# Altium schematic sheet Single_Channel_fNIRS.SchDoc
size A; SheetNumber: 1; SheetTotal: 1
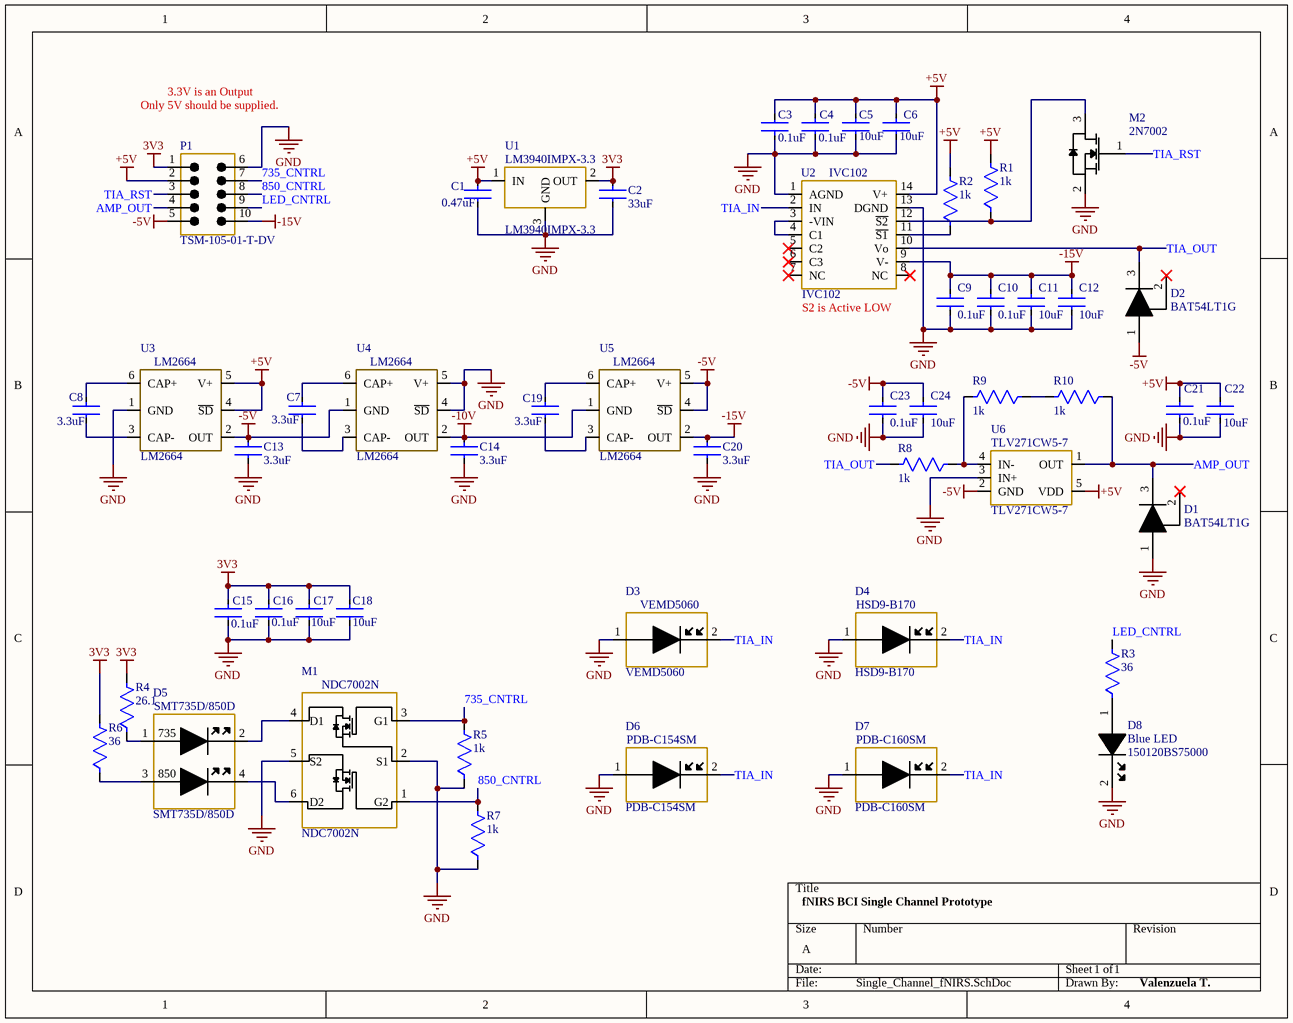
[diagram p0: Single_Channel_fNIRS.SchDoc]

## Parts
C1  0.47uF  [CAPC3216X180N]
C2  33uF  [CAPC3216X180N]
C3  0.1uF  [CAPC3216X180N]
C4  0.1uF  [CAPC3216X180N]
C5  10uF  [CAPC3216X180N]
C6  10uF  [CAPC3216X180N]
C7  3.3uF  [CAPC1210(3225)190_M]
C8  3.3uF  [CAPC1210(3225)190_M]
C9  0.1uF  [CAPC3216X180N]
C10  0.1uF  [CAPC3216X180N]
C11  10uF  [CAPC3216X180N]
C12  10uF  [CAPC3216X180N]
C13  3.3uF  [CAPC1210(3225)190_M]
C14  3.3uF  [CAPC1210(3225)190_M]
C15  0.1uF  [CAPC3216X180N]
C16  0.1uF  [CAPC3216X180N]
C17  10uF  [CAPC3216X180N]
C18  10uF  [CAPC3216X180N]
C19  3.3uF  [CAPC1210(3225)190_M]
C20  3.3uF  [CAPC1210(3225)190_M]
C21  0.1uF  [CAPC3216X180N]
C22  10uF  [CAPC3216X180N]
C23  0.1uF  [CAPC3216X180N]
C24  10uF  [CAPC3216X180N]
D1  BAT54LT1G  [BAT54LT1]
D2  BAT54LT1G  [BAT54LT1]
D3  VEMD5060  [VEMD5060]
D4  HSD9-B170  [HSD9-B170]
D5  SMT735D/850D  [SMT735D_850D]
D6  PDB-C154SM  [PDB-C154SM]
D7  PDB-C160SM  [DS-PDB-C160SM]
D8  Blue LED  [150120BS75000]
M1  NDC7002N  [FAIR-MA06A_V]
M2  2N7002  [STM-SOT-23-3_V]
P1  TSM-105-01-T-DV  [SAMTEC_TSM-105-01-T-DV-TR]
R1  1k  [R1206]
R2  1k  [R1206]
R3  36  [R1206]
R4  26.1  [R1206]
R5  1k  [R1206]
R6  36  [R1206]
R7  1k  [R1206]
R8  1k  [R1206]
R9  1k  [R1206]
R10  1k  [R1206]
U1  LM3940IMPX-3.3  [LM3940]
U2  IVC102  [D0014A_M]
U3  LM2664  [LM2664]
U4  LM2664  [LM2664]
U5  LM2664  [LM2664]
U6  TLV271CW5-7  [SOT95P285X145-5N]

## Nets
3V3: C2.1 C15.1 C16.1 C17.1 C18.1 P1.1 R4.2 R6.2 U1.2(OUT)
+5V: C1.1 C3.2 C4.1 C5.1 C6.1 C21.1 C22.1 P1.2 R1.2 R2.2 U1.1(IN) U2.14(V+) U3.4(~{SD}) U3.5(V+) U6.5(VDD)
-5V: C13.1 C23.1 C24.1 D2.1(A) P1.5 U3.2(OUT) U4.1(GND) U5.4(~{SD}) U5.5(V+) U6.2(GND)
-10V: C14.1 U4.2(OUT) U5.1(GND)
-15V: C9.1 C10.1 C11.1 C12.1 C20.1 P1.10 U2.9(V-) U5.2(OUT)
GND: C1.2 C2.2 C3.1 C4.2 C5.2 C6.2 C9.2 C10.2 C11.2 C12.2 C13.2 C14.2 C15.2 C16.2 C17.2 C18.2 C20.2 C21.2 C22.2 C23.2 C24.2 D1.1(A) D3.1 D4.1 D6.1 D7.1 D8.2 M1.2(S1) M1.5(S2) M2.2(S) P1.6 R5.1 R7.1 U1.3(GND) U2.1(AGND) U2.13(DGND) U3.1(GND) U4.4(~{SD}) U4.5(V+) U6.3(IN+)
735_CNTRL: M1.3(G1) P1.7 R5.2
850_CNTRL: M1.1(G2) P1.8 R7.2
AMP_OUT: D1.3(K) P1.4 R10.1 U6.1(OUT)
LED_CNTRL: P1.9 R3.2
TIA_IN: D3.2 D4.2 D6.2 D7.2 U2.2(IN)
TIA_OUT: D2.3(K) R8.2 U2.10(Vo)
TIA_RST: M2.1(G) P1.3
NetC7_1: C7.1 U4.6(CAP+)
NetC7_2: C7.2 U4.3(CAP-)
NetC8_1: C8.1 U3.6(CAP+)
NetC8_2: C8.2 U3.3(CAP-)
NetC19_1: C19.1 U5.6(CAP+)
NetC19_2: C19.2 U5.3(CAP-)
NetD5_1: D5.1 R4.1
NetD5_2: D5.2 M1.4(D1)
NetD5_3: D5.3 R6.1
NetD5_4: D5.4 M1.6(D2)
NetD8_1: D8.1 R3.1
NetM2_3: M2.3(D) R1.1 U2.12(~{S2})
NetR2_1: R2.1 U2.11(~{S1})
NetR8_1: R8.1 R9.2 U6.4(IN-)
NetR9_1: R9.1 R10.2
NetU2_3: U2.3(-VIN) U2.4(C1)

Not connected (* = marked no-connect by the designer): D1 2(NC)*; D2 2(NC)*; U2 5(C2)* 6(C3)* 7(NC)* 8(NC)*

## Notes on the sheet
- 3.3V is an Output
- Only 5V should be supplied.
- (near U2) S2 is Active LOW
- fNIRS BCI Single Channel Prototype
- 1
- Valenzuela T.
- (in symbol SMT735D/850D) 735; 850

## Library data of the parts
C1 = C3216X7R2A474K160AA: 1206
C2 = C3216X5R1E336M160AC: 1206
C3 C4 C9 C10 C15 C16 C21 C23 = C1206C104K5RAC7210: 1206; Manufacturer: KEMET; Tolerance: 0.1; Material: Ceramic; Voltage Rating: 50 V; Temperature Characteristic: X7R; Automotive Grade: Grade 0; Capacitance: 0.10 μF; Value: 0.10 μF; Temperature Coefficient: 15%; Device Class L3: Ceramic Capacitors; ComponentLink2URL: https://content.kemet.com/datasheets/KEM_C1007_X8R_ULTRA_150C_SMD.pdf; Temperature Range Low: -55°C; RoHS: TRUE; Temperature Range High: +150°C; Automotive: Yes; Height: 0.88mm; Manufacturer Part Number: C1206C104K5RAC7210; Temperature: -55°C to +150°C; Octopart: https://octopart.com/c1206c104k5rac7210-kemet-3919856; Package: C1206C-EB; Mouser Description: Multilayer Ceramic Capacitors MLCC - SMD/SMT 50volts 0.1uF X7R 10%; Ipc Land Pattern Name: CAPC320160X78; Device Class L2: Capacitors; Category: Cap; Lead Free: Yes; ComponentLink2Description: Datasheet; Digikey Description: CAP CER 0.1UF 50V X7R 1206; Device Class L1: Passive Components
C5 C6 C11 C12 C17 C18 C22 C24 = CL31B106KOHNNWE: 1206
C7 C8 C13 C14 C19 C20 = C1210C335K5RAC7800: 1210
D1 D2 = BAT54L: Schottky Barrier Diode, 3-Pin SOT-23, Pb-Free, Tape and Reel; Manufacturer: On Semiconductor; IFSM Max (A): 0.6; Configuration: Single; trr Max (ns): 5; PackageVersion: Rev. AP, 11/2009; ComponentLink3Description: Package Specification; RoHS: TRUE; ComponentLink3URL: http://www.onsemi.cn/pub_link/Collateral/318-08.PDF; PackageDescription: 3-Pin Small Outline Transistor, Body 2.92 x 1.3 mm, Pitch 0.95 mm; DatasheetVersion: Rev. 12; ComponentLink1Description: Manufacturer URL; PartNumber: BAT54LT1G; ComponentLink2Description: Datasheet; Mounting Technology: Surface Mount; PackageReference: SOT-23-3-318-08; ComponentLink2URL: http://www.onsemi.cn/pub_link/Collateral/BAT54LT1-D.PDF; ComponentLink1URL: http://www.onsemi.com/; Packing: Tape and Reel
D8 = 150120BS75000: Single Color LED, Blue, Water Clear, 2mm; Manufacturer: Wurth Electronics; Shape: Rectangular; Forward Current-Max: 30mA; Luminous Intensity-Nom: 145mcd; Number of Functions: 1; Viewing Angle: 140°; Overall Height: 0.68mm; Supplier 1: Newark; Manufacturer Part Number: 150120BS75000; RoHS: Yes; Category: LEDs; Stock 1: 1765; Pricing 1: 1=0.262, 10=0.257, 25=0.25, 50=0.242, 100=0.212, 500=0.194 (USD); Mount: Surface Mount; Number of Pins: 2; Color: Blue; Min Operating Temperature: -40°C; Max Operating Temperature: 85°C; Lens Style: WATER CLEAR; Optoelectronic Device Type: SINGLE COLOR LED; Packaging: Tape and Reel; Size: 2mm; Terminal Pitch: 3mm; Reach SVHC Compliant: Yes; RoHS Compliant: Yes; ComponentLink1URL: https://datasheet.ciiva.com:443/pdfs/VipMasterIC/IC/MIDC/MIDC-S-A0007455946/MIDC-S-A0007455946-1.pdf?src-supplier=IHS+Markit; ComponentLink1Description: https://datasheet.ciiva.com:443/pdfs/VipMasterIC/IC/MIDC/MIDC-S-A0007455946/MIDC-S-A0007455946-1.pdf?src-supplier=IHS+Markit; ComponentLink2URL: https://datasheet.ciiva.com/22656/150120bs75000-22656976.pdf?src-supplier=Element14; ComponentLink2Description: https://datasheet.ciiva.com/22656/150120bs75000-22656976.pdf?src-supplier=Element14; ComponentLink3URL: https://datasheet.ciiva.com/29279/759440-da-01-en-chipled-1206-w-kl-blau-150120bs75000-29279045.pdf?src-supplier=Conrad; ComponentLink3Description: https://datasheet.ciiva.com/29279/759440-da-01-en-chipled-1206-w-kl-blau-150120bs75000-29279045.pdf?src-supplier=Conrad; ComponentLink4URL: https://datasheet.ciiva.com/29561/150120bs75000-29561882.pdf?src-supplier=Digikey; ComponentLink4Description: https://datasheet.ciiva.com/29561/150120bs75000-29561882.pdf?src-supplier=Digikey; Supplier Part Number 1: 150120BS75000
M2 = 2N7002-TP: N-channel 60 V, 1.8 Ohm, 0.35 A STripFET(TM) II Power MOSFET, SOT23; Manufacturer: STMicroelectronics; PartNumber: 2N7002; ComponentLink2Description: Datasheet; ComponentLink2URL: http://www.st.com/st-web-ui/static/active/en/resource/technical/document/datasheet/CD00005134.pdf; ComponentLink1Description: Manufacturer URL; ComponentLink1URL: http://www.st.com/; DatasheetVersion: Rev. 9, 11/2008; PackageReference: SOT-23; Mounting Technology: Surface Mount; PackageDescription: 3-Pin SOT23, 3.016 x 2.8 mm Body, 0.95 mm Pitch
P1 = TSM-105-01-T-DV: 0.025" SQ Post Header, Surface Mount, Vertical, -55 to 105 degC, 2.54 mm Pitch, 10-Pin, Male, RoHS; Manufacturer: Samtec; Pitch: 2.54 mm; ComponentLink3Description: Package Specification; ComponentLink2URL: http://www.samtec.com/documents/webfiles/pdf/TSM.PDF; DatasheetVersion: F-214; Temperature Range: -55 to 105 degC; PackageReference: TSM-105-01-X-DV; PartNumber: TSM-105-01-T-DV; ComponentLink2Description: Datasheet; PackageVersion: DJ, 4/1991; ComponentLink3URL: http://www.samtec.com/documents/webfiles/cpdf/TSM-1XX-XX-XXX-XX-X-XXX-X-MKT.pdf; ComponentLink1URL: http://www.samtec.com; Orientation: Vertical; ComponentLink1Description: Manufacturer URL; RoHS: True; PackageDescription: Double Row Gullwing ASM; Mounting Technology: Surface Mount
R1 R2 R5 R7-R10 = RT1206BRD071KL: 1206 1kOhm
R3 R6 = RT1206BRD0736RL: 1206 36 Ohm; Manufacturer: Yageo; Tolerance: 0.1%; Additional Feature: HIGH PRECISION; Rated Power Dissipation (P): 250mW; Rated Temperature: 70°C; Resistance: 36R; Temperature Coefficient: 25ppm/°C; Working Voltage: 200V; Package Height: 0.55mm; Package Length: 3.1mm; Package Width: 1.6mm; Supplier 1: Digikey; Manufacturer Part Number: RT1206BRD0736RL; RoHS: Yes; Category: Chip SMD Resistors; Stock 1: 9860; Pricing 1: 1=0.33, 10=0.241, 50=0.1868, 100=0.166, 500=0.1245, 1000=0.10938 (USD); Mount: Surface Mount; Number of Pins: 2; Size Code: 1206; Min Operating Temperature: -55°C; Max Operating Temperature: 155°C; Resistor Type: FIXED RESISTOR; Construction: Chip; Package Style: SMTMeter; Packaging: Tape and Reel; Technology: THIN FILM; Termination: Wraparound; Reach SVHC Compliant: Yes; RoHS Compliant: Yes; ComponentLink1URL: https://datasheet.ciiva.com:443/pdfs/VipMasterIC/IC/YAGO/YAGO-S-A0008510989/YAGO-S-A0008510989-1.pdf?src-supplier=IHS+Markit; ComponentLink1Description: https://datasheet.ciiva.com:443/pdfs/VipMasterIC/IC/YAGO/YAGO-S-A0008510989/YAGO-S-A0008510989-1.pdf?src-supplier=IHS+Markit; ComponentLink2URL: https://datasheet.ciiva.com/2587/pyu-rt-1-to-0-05-rohs-l-5-2587658.pdf?src-supplier=Digikey; ComponentLink2Description: https://datasheet.ciiva.com/2587/pyu-rt-1-to-0-05-rohs-l-5-2587658.pdf?src-supplier=Digikey; ComponentLink3URL: https://datasheet.ciiva.com/12811/pyu-rt-1-to-0-05-rohs-l-4-12811975.pdf?src-supplier=Mouser; ComponentLink3Description: https://datasheet.ciiva.com/12811/pyu-rt-1-to-0-05-rohs-l-4-12811975.pdf?src-supplier=Mouser
R4 = RQ73C2B26R1BTD: 1206 26.1 Ohm; Manufacturer: TE; Power Rating: 0.4W; Value: 26.1Ω; Automotive Grade: Grade 0; Voltage Rating: 200V; Temperature Coefficient: 10ppm/°C; Tolerance: 0.1%; Automotive: Yes; Octopart: https://octopart.com/rq73c2b26r1btd-te+connectivity-93911368; Device Class L1: Passive Components; Category: Res; Series: RQ73; Resistance: 26.1Ω; Temperature: -55°C to +155°C; Device Class L3: Chip SMD Resistors; ComponentLink2URL: https://www.te.com/commerce/DocumentDelivery/DDEController?Action=showdoc&DocId=Data+Sheet%7F1773270-2%7FA%7Fpdf%7FEnglish%7FENG_DS_1773270-2_A.pdf%7F9-2176388-167; Composition: Thin Film; Manufacturer Part Number: RQ73C2B26R1BTD; Height: 0.75mm; Lead Free: Yes; Ipc Land Pattern Name: RESC310160X60; Temperature Range High: +155°C; ComponentLink2Description: Datasheet; Temperature Range Low: -55°C; RoHS: TRUE; Device Class L2: Resistors; Package: RQ732B
U3-U5 = LM2664: Switched Capacitor Voltage Converter, 6-pin SOT-23; Manufacturer: Texas Instruments; CompType: Switch Caps; PackageTopMarking: S03A*XTT; PowerWise: N; PackageDescription: Molded SOT-23, .115 x .063 x .040in Body, 6 Lead, .0375in in Pitch; Code_IPC: SOT26A-6; PinCount: 6; PackageReference: DBV0006A; ComponentLink1URL: http://www.ti.com/general/docs/lit/getliterature.tsp?genericPartNumber=LM2664&fileType=pdf; Code_JEDEC: MO-178-AB; ComponentLink1Description: Datasheet URL; RoHS: N